# EAGLE schematic PJ22 (EAGLE 7.4.0)
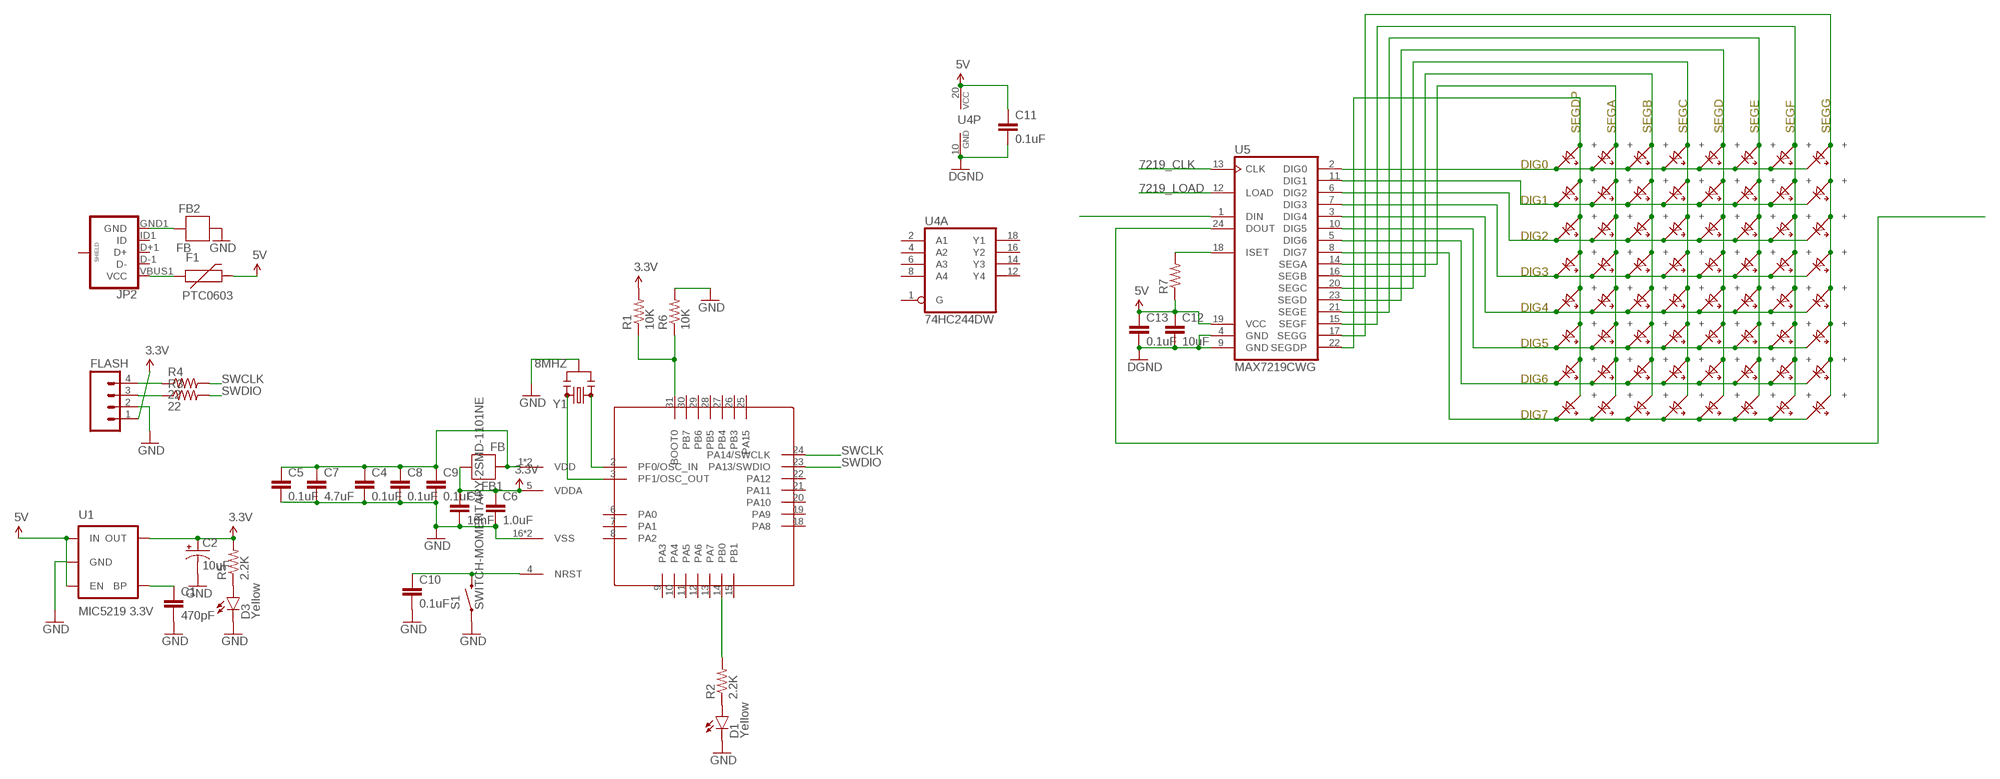
[diagram p0: schematic, sheet 1]

## Parts
C1  470pF  CAP0402-CAP  [0402-CAP]
C2  10uF  10UF-16V-10%(TANT)  [EIA3216]
C3  10nF  CAP0402-CAP  [0402-CAP]
C4  0.1uF  CAP0402-CAP  [0402-CAP]
C5  0.1uF  CAP0402-CAP  [0402-CAP]
C6  1.0uF  1.0UF-16V-10%(0603)  [0603-CAP]
C7  4.7uF  4.7UF-6.3V-10%(0603)0603  [0603-CAP]
C8  0.1uF  CAP0402-CAP  [0402-CAP]
C9  0.1uF  CAP0402-CAP  [0402-CAP]
C10  0.1uF  CAP0402-CAP  [0402-CAP]
C11  0.1uF  0.1UF-25V-5%(0603)  [0603-CAP]
C12  10uF  10UF50V20%(1210)  [1210]
C13  0.1uF  0.1UF-25V-5%(0603)  [0603-CAP]
D1  Yellow  LED-YELLOW0603  [LED-0603]
D3  Yellow  LED-YELLOW0603  [LED-0603]
DC1  LED_COMP  [LED_COMP]
DC2  LED_COMP  [LED_COMP]
DC3  LED_COMP  [LED_COMP]
DC4  LED_COMP  [LED_COMP]
DC5  LED_COMP  [LED_COMP]
DC6  LED_COMP  [LED_COMP]
DC7  LED_COMP  [LED_COMP]
DC8  LED_COMP  [LED_COMP]
DC9  LED_COMP  [LED_COMP]
DC10  LED_COMP  [LED_COMP]
DC11  LED_COMP  [LED_COMP]
DC12  LED_COMP  [LED_COMP]
DC13  LED_COMP  [LED_COMP]
DC14  LED_COMP  [LED_COMP]
DC15  LED_COMP  [LED_COMP]
DC16  LED_COMP  [LED_COMP]
DC17  LED_COMP  [LED_COMP]
DC18  LED_COMP  [LED_COMP]
DC19  LED_COMP  [LED_COMP]
DC20  LED_COMP  [LED_COMP]
DC21  LED_COMP  [LED_COMP]
DC22  LED_COMP  [LED_COMP]
DC23  LED_COMP  [LED_COMP]
DC24  LED_COMP  [LED_COMP]
DC25  LED_COMP  [LED_COMP]
DC26  LED_COMP  [LED_COMP]
DC27  LED_COMP  [LED_COMP]
DC28  LED_COMP  [LED_COMP]
DC29  LED_COMP  [LED_COMP]
DC30  LED_COMP  [LED_COMP]
DC31  LED_COMP  [LED_COMP]
DC32  LED_COMP  [LED_COMP]
DC33  LED_COMP  [LED_COMP]
DC34  LED_COMP  [LED_COMP]
DC35  LED_COMP  [LED_COMP]
DC36  LED_COMP  [LED_COMP]
DC37  LED_COMP  [LED_COMP]
DC38  LED_COMP  [LED_COMP]
DC39  LED_COMP  [LED_COMP]
DC40  LED_COMP  [LED_COMP]
DC41  LED_COMP  [LED_COMP]
DC42  LED_COMP  [LED_COMP]
DC43  LED_COMP  [LED_COMP]
DC44  LED_COMP  [LED_COMP]
DC45  LED_COMP  [LED_COMP]
DC46  LED_COMP  [LED_COMP]
DC47  LED_COMP  [LED_COMP]
DC48  LED_COMP  [LED_COMP]
DC49  LED_COMP  [LED_COMP]
DC50  LED_COMP  [LED_COMP]
DC51  LED_COMP  [LED_COMP]
DC52  LED_COMP  [LED_COMP]
DC53  LED_COMP  [LED_COMP]
DC54  LED_COMP  [LED_COMP]
DC55  LED_COMP  [LED_COMP]
DC56  LED_COMP  [LED_COMP]
DC57  LED_COMP  [LED_COMP]
DC58  LED_COMP  [LED_COMP]
DC59  LED_COMP  [LED_COMP]
DC60  LED_COMP  [LED_COMP]
DC61  LED_COMP  [LED_COMP]
DC62  LED_COMP  [LED_COMP]
DC63  LED_COMP  [LED_COMP]
DC64  LED_COMP  [LED_COMP]
F1  PTC0603  [0603]
FB1  FB  [0603]
FB2  FB  [0603]
FLASH  M04SMD  [1X04-SMD]
JP2  USB_MICROB_PLUGCONN-11752  [USB-B-MICRO-SMD_V03]
R1  10K  22OHM1/10W1%(0402)  [0402-RES]
R2  2.2K  RESISTOR0402  [0402-RES]
R3  22  22OHM1/10W1%(0402)  [0402-RES]
R4  22  22OHM1/10W1%(0402)  [0402-RES]
R5  2.2K  RESISTOR0402  [0402-RES]
R6  10K  22OHM1/10W1%(0402)  [0402-RES]
R7  RESISTOR0805-RES  [0805]
S1  SWITCH-MOMENTARY-2SMD-1101NE  [TACTILE-SWITCH-1101NE]
U1  MIC5219 3.3V  V_REG_MIC52193.3V  [SOT23-5]
U2  STM32F030K6P6  [LQFP32-0.8]
U4  74HC244DW  [SO20W]
U5  MAX7219CWG  [SO24L]
Y1  8MHZ  RESONATOR8MHZ  [RESONATOR-SMD]

## Nets
3.3V: C2.A(+) C3.1 C6.1 FB1.1 FLASH.1 R1.2 R5.2 U1.5(OUT) U2.5(VDDA)
5V: C11.1 C12.1 C13.1 F1.2 R7.1 U1.1(IN) U1.3(EN) U4.20(P:VCC) U5.19(VCC)
7219_CLK: U5.13(CLK)
7219_LOAD: U5.12(LOAD)
COPOY: C1.2 C2.C(-) C3.2 C4.2 C5.2 C6.2 C7.2 C8.2 C9.2 C10.2 D1.C D3.C FB2.1 FLASH.2 R6.2 S1.1 U1.2(GND) U2.16(VSS) U2.32(VSS) Y1.2 ; supply symbol labelled GND
GND: C11.2 C12.2 C13.2 U4.10(P:GND) U5.4(GND) U5.9(GND) ; supply symbol labelled DGND
N$1: C4.1 C5.1 C7.1 C8.1 C9.1 FB1.2 U2.1(VDD) U2.17(VDD)
N$2: DC1.0603-(-) DC1.0805-(-) DC1.1206-(-) DC1.3528-(-) DC1.5050-1(-) DC1.5050-3(-) DC1.5050-5(-) DC2.0603-(-) DC2.0805-(-) DC2.1206-(-) DC2.3528-(-) DC2.5050-1(-) DC2.5050-3(-) DC2.5050-5(-) DC3.0603-(-) DC3.0805-(-) DC3.1206-(-) DC3.3528-(-) DC3.5050-1(-) DC3.5050-3(-) DC3.5050-5(-) DC4.0603-(-) DC4.0805-(-) DC4.1206-(-) DC4.3528-(-) DC4.5050-1(-) DC4.5050-3(-) DC4.5050-5(-) DC5.0603-(-) DC5.0805-(-) DC5.1206-(-) DC5.3528-(-) DC5.5050-1(-) DC5.5050-3(-) DC5.5050-5(-) DC6.0603-(-) DC6.0805-(-) DC6.1206-(-) DC6.3528-(-) DC6.5050-1(-) DC6.5050-3(-) DC6.5050-5(-) DC7.0603-(-) DC7.0805-(-) DC7.1206-(-) DC7.3528-(-) DC7.5050-1(-) DC7.5050-3(-) DC7.5050-5(-) DC8.0603-(-) DC8.0805-(-) DC8.1206-(-) DC8.3528-(-) DC8.5050-1(-) DC8.5050-3(-) DC8.5050-5(-) U5.2(DIG0)
N$3: C1.1 U1.4(BP)
N$4: FLASH.3 R3.1
N$5: FLASH.4 R4.1
N$6: DC9.0603-(-) DC9.0805-(-) DC9.1206-(-) DC9.3528-(-) DC9.5050-1(-) DC9.5050-3(-) DC9.5050-5(-) DC10.0603-(-) DC10.0805-(-) DC10.1206-(-) DC10.3528-(-) DC10.5050-1(-) DC10.5050-3(-) DC10.5050-5(-) DC11.0603-(-) DC11.0805-(-) DC11.1206-(-) DC11.3528-(-) DC11.5050-1(-) DC11.5050-3(-) DC11.5050-5(-) DC12.0603-(-) DC12.0805-(-) DC12.1206-(-) DC12.3528-(-) DC12.5050-1(-) DC12.5050-3(-) DC12.5050-5(-) DC13.0603-(-) DC13.0805-(-) DC13.1206-(-) DC13.3528-(-) DC13.5050-1(-) DC13.5050-3(-) DC13.5050-5(-) DC14.0603-(-) DC14.0805-(-) DC14.1206-(-) DC14.3528-(-) DC14.5050-1(-) DC14.5050-3(-) DC14.5050-5(-) DC15.0603-(-) DC15.0805-(-) DC15.1206-(-) DC15.3528-(-) DC15.5050-1(-) DC15.5050-3(-) DC15.5050-5(-) DC16.0603-(-) DC16.0805-(-) DC16.1206-(-) DC16.3528-(-) DC16.5050-1(-) DC16.5050-3(-) DC16.5050-5(-) U5.11(DIG1)
N$7: D1.A R2.1
N$8: DC1.0603+(+) DC1.0805+(+) DC1.1206+(+) DC1.3528+(+) DC1.5050-2(+) DC1.5050-4(+) DC1.5050-6(+) DC9.0603+(+) DC9.0805+(+) DC9.1206+(+) DC9.3528+(+) DC9.5050-2(+) DC9.5050-4(+) DC9.5050-6(+) DC17.0603+(+) DC17.0805+(+) DC17.1206+(+) DC17.3528+(+) DC17.5050-2(+) DC17.5050-4(+) DC17.5050-6(+) DC25.0603+(+) DC25.0805+(+) DC25.1206+(+) DC25.3528+(+) DC25.5050-2(+) DC25.5050-4(+) DC25.5050-6(+) DC33.0603+(+) DC33.0805+(+) DC33.1206+(+) DC33.3528+(+) DC33.5050-2(+) DC33.5050-4(+) DC33.5050-6(+) DC41.0603+(+) DC41.0805+(+) DC41.1206+(+) DC41.3528+(+) DC41.5050-2(+) DC41.5050-4(+) DC41.5050-6(+) DC49.0603+(+) DC49.0805+(+) DC49.1206+(+) DC49.3528+(+) DC49.5050-2(+) DC49.5050-4(+) DC49.5050-6(+) DC57.0603+(+) DC57.0805+(+) DC57.1206+(+) DC57.3528+(+) DC57.5050-2(+) DC57.5050-4(+) DC57.5050-6(+) U5.22(SEGDP)
N$9: R1.1 R6.1 U2.31(BOOT0)
N$10: DC2.0603+(+) DC2.0805+(+) DC2.1206+(+) DC2.3528+(+) DC2.5050-2(+) DC2.5050-4(+) DC2.5050-6(+) DC10.0603+(+) DC10.0805+(+) DC10.1206+(+) DC10.3528+(+) DC10.5050-2(+) DC10.5050-4(+) DC10.5050-6(+) DC18.0603+(+) DC18.0805+(+) DC18.1206+(+) DC18.3528+(+) DC18.5050-2(+) DC18.5050-4(+) DC18.5050-6(+) DC26.0603+(+) DC26.0805+(+) DC26.1206+(+) DC26.3528+(+) DC26.5050-2(+) DC26.5050-4(+) DC26.5050-6(+) DC34.0603+(+) DC34.0805+(+) DC34.1206+(+) DC34.3528+(+) DC34.5050-2(+) DC34.5050-4(+) DC34.5050-6(+) DC42.0603+(+) DC42.0805+(+) DC42.1206+(+) DC42.3528+(+) DC42.5050-2(+) DC42.5050-4(+) DC42.5050-6(+) DC50.0603+(+) DC50.0805+(+) DC50.1206+(+) DC50.3528+(+) DC50.5050-2(+) DC50.5050-4(+) DC50.5050-6(+) DC58.0603+(+) DC58.0805+(+) DC58.1206+(+) DC58.3528+(+) DC58.5050-2(+) DC58.5050-4(+) DC58.5050-6(+) U5.14(SEGA)
N$11: FB2.2 JP2.GND1(GND)
N$12: F1.1 JP2.VBUS1(VCC)
N$13: DC3.0603+(+) DC3.0805+(+) DC3.1206+(+) DC3.3528+(+) DC3.5050-2(+) DC3.5050-4(+) DC3.5050-6(+) DC11.0603+(+) DC11.0805+(+) DC11.1206+(+) DC11.3528+(+) DC11.5050-2(+) DC11.5050-4(+) DC11.5050-6(+) DC19.0603+(+) DC19.0805+(+) DC19.1206+(+) DC19.3528+(+) DC19.5050-2(+) DC19.5050-4(+) DC19.5050-6(+) DC27.0603+(+) DC27.0805+(+) DC27.1206+(+) DC27.3528+(+) DC27.5050-2(+) DC27.5050-4(+) DC27.5050-6(+) DC35.0603+(+) DC35.0805+(+) DC35.1206+(+) DC35.3528+(+) DC35.5050-2(+) DC35.5050-4(+) DC35.5050-6(+) DC43.0603+(+) DC43.0805+(+) DC43.1206+(+) DC43.3528+(+) DC43.5050-2(+) DC43.5050-4(+) DC43.5050-6(+) DC51.0603+(+) DC51.0805+(+) DC51.1206+(+) DC51.3528+(+) DC51.5050-2(+) DC51.5050-4(+) DC51.5050-6(+) DC59.0603+(+) DC59.0805+(+) DC59.1206+(+) DC59.3528+(+) DC59.5050-2(+) DC59.5050-4(+) DC59.5050-6(+) U5.16(SEGB)
N$14: DC4.0603+(+) DC4.0805+(+) DC4.1206+(+) DC4.3528+(+) DC4.5050-2(+) DC4.5050-4(+) DC4.5050-6(+) DC12.0603+(+) DC12.0805+(+) DC12.1206+(+) DC12.3528+(+) DC12.5050-2(+) DC12.5050-4(+) DC12.5050-6(+) DC20.0603+(+) DC20.0805+(+) DC20.1206+(+) DC20.3528+(+) DC20.5050-2(+) DC20.5050-4(+) DC20.5050-6(+) DC28.0603+(+) DC28.0805+(+) DC28.1206+(+) DC28.3528+(+) DC28.5050-2(+) DC28.5050-4(+) DC28.5050-6(+) DC36.0603+(+) DC36.0805+(+) DC36.1206+(+) DC36.3528+(+) DC36.5050-2(+) DC36.5050-4(+) DC36.5050-6(+) DC44.0603+(+) DC44.0805+(+) DC44.1206+(+) DC44.3528+(+) DC44.5050-2(+) DC44.5050-4(+) DC44.5050-6(+) DC52.0603+(+) DC52.0805+(+) DC52.1206+(+) DC52.3528+(+) DC52.5050-2(+) DC52.5050-4(+) DC52.5050-6(+) DC60.0603+(+) DC60.0805+(+) DC60.1206+(+) DC60.3528+(+) DC60.5050-2(+) DC60.5050-4(+) DC60.5050-6(+) U5.20(SEGC)
N$15: DC5.0603+(+) DC5.0805+(+) DC5.1206+(+) DC5.3528+(+) DC5.5050-2(+) DC5.5050-4(+) DC5.5050-6(+) DC13.0603+(+) DC13.0805+(+) DC13.1206+(+) DC13.3528+(+) DC13.5050-2(+) DC13.5050-4(+) DC13.5050-6(+) DC21.0603+(+) DC21.0805+(+) DC21.1206+(+) DC21.3528+(+) DC21.5050-2(+) DC21.5050-4(+) DC21.5050-6(+) DC29.0603+(+) DC29.0805+(+) DC29.1206+(+) DC29.3528+(+) DC29.5050-2(+) DC29.5050-4(+) DC29.5050-6(+) DC37.0603+(+) DC37.0805+(+) DC37.1206+(+) DC37.3528+(+) DC37.5050-2(+) DC37.5050-4(+) DC37.5050-6(+) DC45.0603+(+) DC45.0805+(+) DC45.1206+(+) DC45.3528+(+) DC45.5050-2(+) DC45.5050-4(+) DC45.5050-6(+) DC53.0603+(+) DC53.0805+(+) DC53.1206+(+) DC53.3528+(+) DC53.5050-2(+) DC53.5050-4(+) DC53.5050-6(+) DC61.0603+(+) DC61.0805+(+) DC61.1206+(+) DC61.3528+(+) DC61.5050-2(+) DC61.5050-4(+) DC61.5050-6(+) U5.23(SEGD)
N$16: DC6.0603+(+) DC6.0805+(+) DC6.1206+(+) DC6.3528+(+) DC6.5050-2(+) DC6.5050-4(+) DC6.5050-6(+) DC14.0603+(+) DC14.0805+(+) DC14.1206+(+) DC14.3528+(+) DC14.5050-2(+) DC14.5050-4(+) DC14.5050-6(+) DC22.0603+(+) DC22.0805+(+) DC22.1206+(+) DC22.3528+(+) DC22.5050-2(+) DC22.5050-4(+) DC22.5050-6(+) DC30.0603+(+) DC30.0805+(+) DC30.1206+(+) DC30.3528+(+) DC30.5050-2(+) DC30.5050-4(+) DC30.5050-6(+) DC38.0603+(+) DC38.0805+(+) DC38.1206+(+) DC38.3528+(+) DC38.5050-2(+) DC38.5050-4(+) DC38.5050-6(+) DC46.0603+(+) DC46.0805+(+) DC46.1206+(+) DC46.3528+(+) DC46.5050-2(+) DC46.5050-4(+) DC46.5050-6(+) DC54.0603+(+) DC54.0805+(+) DC54.1206+(+) DC54.3528+(+) DC54.5050-2(+) DC54.5050-4(+) DC54.5050-6(+) DC62.0603+(+) DC62.0805+(+) DC62.1206+(+) DC62.3528+(+) DC62.5050-2(+) DC62.5050-4(+) DC62.5050-6(+) U5.21(SEGE)
N$17: DC7.0603+(+) DC7.0805+(+) DC7.1206+(+) DC7.3528+(+) DC7.5050-2(+) DC7.5050-4(+) DC7.5050-6(+) DC15.0603+(+) DC15.0805+(+) DC15.1206+(+) DC15.3528+(+) DC15.5050-2(+) DC15.5050-4(+) DC15.5050-6(+) DC23.0603+(+) DC23.0805+(+) DC23.1206+(+) DC23.3528+(+) DC23.5050-2(+) DC23.5050-4(+) DC23.5050-6(+) DC31.0603+(+) DC31.0805+(+) DC31.1206+(+) DC31.3528+(+) DC31.5050-2(+) DC31.5050-4(+) DC31.5050-6(+) DC39.0603+(+) DC39.0805+(+) DC39.1206+(+) DC39.3528+(+) DC39.5050-2(+) DC39.5050-4(+) DC39.5050-6(+) DC47.0603+(+) DC47.0805+(+) DC47.1206+(+) DC47.3528+(+) DC47.5050-2(+) DC47.5050-4(+) DC47.5050-6(+) DC55.0603+(+) DC55.0805+(+) DC55.1206+(+) DC55.3528+(+) DC55.5050-2(+) DC55.5050-4(+) DC55.5050-6(+) DC63.0603+(+) DC63.0805+(+) DC63.1206+(+) DC63.3528+(+) DC63.5050-2(+) DC63.5050-4(+) DC63.5050-6(+) U5.15(SEGF)
N$18: DC8.0603+(+) DC8.0805+(+) DC8.1206+(+) DC8.3528+(+) DC8.5050-2(+) DC8.5050-4(+) DC8.5050-6(+) DC16.0603+(+) DC16.0805+(+) DC16.1206+(+) DC16.3528+(+) DC16.5050-2(+) DC16.5050-4(+) DC16.5050-6(+) DC24.0603+(+) DC24.0805+(+) DC24.1206+(+) DC24.3528+(+) DC24.5050-2(+) DC24.5050-4(+) DC24.5050-6(+) DC32.0603+(+) DC32.0805+(+) DC32.1206+(+) DC32.3528+(+) DC32.5050-2(+) DC32.5050-4(+) DC32.5050-6(+) DC40.0603+(+) DC40.0805+(+) DC40.1206+(+) DC40.3528+(+) DC40.5050-2(+) DC40.5050-4(+) DC40.5050-6(+) DC48.0603+(+) DC48.0805+(+) DC48.1206+(+) DC48.3528+(+) DC48.5050-2(+) DC48.5050-4(+) DC48.5050-6(+) DC56.0603+(+) DC56.0805+(+) DC56.1206+(+) DC56.3528+(+) DC56.5050-2(+) DC56.5050-4(+) DC56.5050-6(+) DC64.0603+(+) DC64.0805+(+) DC64.1206+(+) DC64.3528+(+) DC64.5050-2(+) DC64.5050-4(+) DC64.5050-6(+) U5.17(SEGG)
N$19: DC17.0603-(-) DC17.0805-(-) DC17.1206-(-) DC17.3528-(-) DC17.5050-1(-) DC17.5050-3(-) DC17.5050-5(-) DC18.0603-(-) DC18.0805-(-) DC18.1206-(-) DC18.3528-(-) DC18.5050-1(-) DC18.5050-3(-) DC18.5050-5(-) DC19.0603-(-) DC19.0805-(-) DC19.1206-(-) DC19.3528-(-) DC19.5050-1(-) DC19.5050-3(-) DC19.5050-5(-) DC20.0603-(-) DC20.0805-(-) DC20.1206-(-) DC20.3528-(-) DC20.5050-1(-) DC20.5050-3(-) DC20.5050-5(-) DC21.0603-(-) DC21.0805-(-) DC21.1206-(-) DC21.3528-(-) DC21.5050-1(-) DC21.5050-3(-) DC21.5050-5(-) DC22.0603-(-) DC22.0805-(-) DC22.1206-(-) DC22.3528-(-) DC22.5050-1(-) DC22.5050-3(-) DC22.5050-5(-) DC23.0603-(-) DC23.0805-(-) DC23.1206-(-) DC23.3528-(-) DC23.5050-1(-) DC23.5050-3(-) DC23.5050-5(-) DC24.0603-(-) DC24.0805-(-) DC24.1206-(-) DC24.3528-(-) DC24.5050-1(-) DC24.5050-3(-) DC24.5050-5(-) U5.6(DIG2)
N$20: DC25.0603-(-) DC25.0805-(-) DC25.1206-(-) DC25.3528-(-) DC25.5050-1(-) DC25.5050-3(-) DC25.5050-5(-) DC26.0603-(-) DC26.0805-(-) DC26.1206-(-) DC26.3528-(-) DC26.5050-1(-) DC26.5050-3(-) DC26.5050-5(-) DC27.0603-(-) DC27.0805-(-) DC27.1206-(-) DC27.3528-(-) DC27.5050-1(-) DC27.5050-3(-) DC27.5050-5(-) DC28.0603-(-) DC28.0805-(-) DC28.1206-(-) DC28.3528-(-) DC28.5050-1(-) DC28.5050-3(-) DC28.5050-5(-) DC29.0603-(-) DC29.0805-(-) DC29.1206-(-) DC29.3528-(-) DC29.5050-1(-) DC29.5050-3(-) DC29.5050-5(-) DC30.0603-(-) DC30.0805-(-) DC30.1206-(-) DC30.3528-(-) DC30.5050-1(-) DC30.5050-3(-) DC30.5050-5(-) DC31.0603-(-) DC31.0805-(-) DC31.1206-(-) DC31.3528-(-) DC31.5050-1(-) DC31.5050-3(-) DC31.5050-5(-) DC32.0603-(-) DC32.0805-(-) DC32.1206-(-) DC32.3528-(-) DC32.5050-1(-) DC32.5050-3(-) DC32.5050-5(-) U5.7(DIG3)
N$21: DC33.0603-(-) DC33.0805-(-) DC33.1206-(-) DC33.3528-(-) DC33.5050-1(-) DC33.5050-3(-) DC33.5050-5(-) DC34.0603-(-) DC34.0805-(-) DC34.1206-(-) DC34.3528-(-) DC34.5050-1(-) DC34.5050-3(-) DC34.5050-5(-) DC35.0603-(-) DC35.0805-(-) DC35.1206-(-) DC35.3528-(-) DC35.5050-1(-) DC35.5050-3(-) DC35.5050-5(-) DC36.0603-(-) DC36.0805-(-) DC36.1206-(-) DC36.3528-(-) DC36.5050-1(-) DC36.5050-3(-) DC36.5050-5(-) DC37.0603-(-) DC37.0805-(-) DC37.1206-(-) DC37.3528-(-) DC37.5050-1(-) DC37.5050-3(-) DC37.5050-5(-) DC38.0603-(-) DC38.0805-(-) DC38.1206-(-) DC38.3528-(-) DC38.5050-1(-) DC38.5050-3(-) DC38.5050-5(-) DC39.0603-(-) DC39.0805-(-) DC39.1206-(-) DC39.3528-(-) DC39.5050-1(-) DC39.5050-3(-) DC39.5050-5(-) DC40.0603-(-) DC40.0805-(-) DC40.1206-(-) DC40.3528-(-) DC40.5050-1(-) DC40.5050-3(-) DC40.5050-5(-) U5.3(DIG4)
N$22: DC41.0603-(-) DC41.0805-(-) DC41.1206-(-) DC41.3528-(-) DC41.5050-1(-) DC41.5050-3(-) DC41.5050-5(-) DC42.0603-(-) DC42.0805-(-) DC42.1206-(-) DC42.3528-(-) DC42.5050-1(-) DC42.5050-3(-) DC42.5050-5(-) DC43.0603-(-) DC43.0805-(-) DC43.1206-(-) DC43.3528-(-) DC43.5050-1(-) DC43.5050-3(-) DC43.5050-5(-) DC44.0603-(-) DC44.0805-(-) DC44.1206-(-) DC44.3528-(-) DC44.5050-1(-) DC44.5050-3(-) DC44.5050-5(-) DC45.0603-(-) DC45.0805-(-) DC45.1206-(-) DC45.3528-(-) DC45.5050-1(-) DC45.5050-3(-) DC45.5050-5(-) DC46.0603-(-) DC46.0805-(-) DC46.1206-(-) DC46.3528-(-) DC46.5050-1(-) DC46.5050-3(-) DC46.5050-5(-) DC47.0603-(-) DC47.0805-(-) DC47.1206-(-) DC47.3528-(-) DC47.5050-1(-) DC47.5050-3(-) DC47.5050-5(-) DC48.0603-(-) DC48.0805-(-) DC48.1206-(-) DC48.3528-(-) DC48.5050-1(-) DC48.5050-3(-) DC48.5050-5(-) U5.10(DIG5)
N$23: DC49.0603-(-) DC49.0805-(-) DC49.1206-(-) DC49.3528-(-) DC49.5050-1(-) DC49.5050-3(-) DC49.5050-5(-) DC50.0603-(-) DC50.0805-(-) DC50.1206-(-) DC50.3528-(-) DC50.5050-1(-) DC50.5050-3(-) DC50.5050-5(-) DC51.0603-(-) DC51.0805-(-) DC51.1206-(-) DC51.3528-(-) DC51.5050-1(-) DC51.5050-3(-) DC51.5050-5(-) DC52.0603-(-) DC52.0805-(-) DC52.1206-(-) DC52.3528-(-) DC52.5050-1(-) DC52.5050-3(-) DC52.5050-5(-) DC53.0603-(-) DC53.0805-(-) DC53.1206-(-) DC53.3528-(-) DC53.5050-1(-) DC53.5050-3(-) DC53.5050-5(-) DC54.0603-(-) DC54.0805-(-) DC54.1206-(-) DC54.3528-(-) DC54.5050-1(-) DC54.5050-3(-) DC54.5050-5(-) DC55.0603-(-) DC55.0805-(-) DC55.1206-(-) DC55.3528-(-) DC55.5050-1(-) DC55.5050-3(-) DC55.5050-5(-) DC56.0603-(-) DC56.0805-(-) DC56.1206-(-) DC56.3528-(-) DC56.5050-1(-) DC56.5050-3(-) DC56.5050-5(-) U5.5(DIG6)
N$24: DC57.0603-(-) DC57.0805-(-) DC57.1206-(-) DC57.3528-(-) DC57.5050-1(-) DC57.5050-3(-) DC57.5050-5(-) DC58.0603-(-) DC58.0805-(-) DC58.1206-(-) DC58.3528-(-) DC58.5050-1(-) DC58.5050-3(-) DC58.5050-5(-) DC59.0603-(-) DC59.0805-(-) DC59.1206-(-) DC59.3528-(-) DC59.5050-1(-) DC59.5050-3(-) DC59.5050-5(-) DC60.0603-(-) DC60.0805-(-) DC60.1206-(-) DC60.3528-(-) DC60.5050-1(-) DC60.5050-3(-) DC60.5050-5(-) DC61.0603-(-) DC61.0805-(-) DC61.1206-(-) DC61.3528-(-) DC61.5050-1(-) DC61.5050-3(-) DC61.5050-5(-) DC62.0603-(-) DC62.0805-(-) DC62.1206-(-) DC62.3528-(-) DC62.5050-1(-) DC62.5050-3(-) DC62.5050-5(-) DC63.0603-(-) DC63.0805-(-) DC63.1206-(-) DC63.3528-(-) DC63.5050-1(-) DC63.5050-3(-) DC63.5050-5(-) DC64.0603-(-) DC64.0805-(-) DC64.1206-(-) DC64.3528-(-) DC64.5050-1(-) DC64.5050-3(-) DC64.5050-5(-) U5.8(DIG7)
N$26: R7.2 U5.18(ISET)
N$27: U5.1(DIN)
N$28: U5.24(DOUT)
N$32: D3.A R5.1
NRST: C10.1 S1.2 U2.4(NRST)
PB0: R2.2 U2.14(PB0)
PF0: U2.2(PF0/OSC_IN) Y1.1
PF1: U2.3(PF1/OSC_OUT) Y1.3
SWCLK: R4.2 U2.24(PA14/SWCLK)
SWDIO: R3.2 U2.23(PA13/SWDIO)
Unconnected: JP2.D+1(D+) JP2.D-1(D-) JP2.ID1(ID) JP2.SHIELD1(SHIELD) JP2.SHIELD2(SHIELD) JP2.SHIELD3(SHIELD) U2.6(PA0) U2.7(PA1) U2.8(PA2) U2.9(PA3) U2.10(PA4) U2.11(PA5) U2.12(PA6) U2.13(PA7) U2.15(PB1) U2.18(PA8) U2.19(PA9) U2.20(PA10) U2.21(PA11) U2.22(PA12) U2.25(PA15) U2.26(PB3) U2.27(PB4) U2.28(PB5) U2.29(PB6) U2.30(PB7) U4.1(A:G) U4.2(A:A1) U4.3(B:Y4) U4.4(A:A2) U4.5(B:Y3) U4.6(A:A3) U4.7(B:Y2) U4.8(A:A4) U4.9(B:Y1) U4.11(B:A1) U4.12(A:Y4) U4.13(B:A2) U4.14(A:Y3) U4.15(B:A3) U4.16(A:Y2) U4.17(B:A4) U4.18(A:Y1) U4.19(B:G)

## Notes on the sheet
- SEGDP | SEGA | SEGB | SEGC | SEGD | SEGE | SEGF | SEGG
- DIG0
- DIG1
- DIG2
- DIG3
- DIG4
- DIG5
- DIG6
- DIG7

## Library data of the parts
C1 C3-C5 C8-C10 = SparkFun-Capacitors:CAP: Capacitor Standard 0603 ceramic capacitor, and 0.1" leaded capacitor.
C2 = SparkFun-Capacitors:10UF-16V-10%(TANT): CAP-00811 1206/EIA-3216 Tantalum capacitor; PROD_ID: CAP-00811
C6 = SparkFun-Capacitors:1.0UF-16V-10%(0603): CAP-00868; PROD_ID: CAP-00868
C7 = SparkFun-Capacitors:4.7UF-6.3V-10%(0603): CAP-08280; PROD_ID: CAP-08280
C11 C13 = SparkFun-Capacitors:0.1UF-25V-5%(0603): CAP-08604; PROD_ID: CAP-08604
C12 = SparkFun-Capacitors:10UF50V20%(1210): CAP-09824; PROD_ID: CAP-09824
D1 D3 = SparkFun-LED:LED-YELLOW: Yellow SMD LEDs LilyPad 1206- DIO-09909 0603- DIO-09003 "SMART" means more efficient and expensive; PROD_ID: DIO-09003
DC1-DC64 = PJ22:LED_COMP
F1 = SparkFun-PowerIC:PTC: Resettable Fuse PTC Resettable Fuse. Spark Fun Electronics SKU : COM-08357
FB1 FB2 = SparkFun-Passives:FB
FLASH = SparkFun-Connectors:M04: Header 4 Standard 4-pin 0.1" header. Use with straight break away headers (SKU : PRT-00116), right angle break away headers (PRT-00553), swiss pins (PRT-00743), machine pins (PRT-00117), and female headers (PRT-00115). Molex polarized connector foot print use with SKU : PRT-08231 with associated crimp pins and housings. 1MM SMD Version SKU: PRT-10208
JP2 = SparkFun-Connectors:USB_MICROB_PLUG: USB Micro-B connectors Some male, some female. Watch your step!; PROD_ID: CONN-11752
R1 R6 = SparkFun-Resistors:22OHM1/10W1%(0402); PROD_ID: RES-12427; VALUE: 22
R2 R5 R7 = SparkFun-Resistors:RESISTOR: Resistor Basic schematic elements and footprints for 0603, 1206, and PTH resistors.
R3 R4 = SparkFun-Resistors:22OHM1/10W1%(0402); PROD_ID: RES-12427
S1 = SparkFun-Electromechanical:SWITCH-MOMENTARY-2: Various NO switches- pushbuttons, reed, etc; PROD_ID: SWCH-00815
U1 = SparkFun-PowerIC:V_REG_MIC5219: V_REG MIC5219 Standard 3.3V and 5V 500mA LDO voltage regulator in SOT-23 layout. Micrel part MIC5219. BP (by-pass) pin is used to lower output noise with 470pF cap, may be left open.; PROD_ID: VREG-09872
U2 = r1:STM32F030K6P6
U4 = 74xx-eu:74*244: Octal BUFFER and LINE DRIVER, 3-state
U5 = maxim:MAX7219: LED DISPLAY DRIVER
Y1 = SparkFun-FreqCtrl:RESONATOR: Resonator Small SMD resonator. Used, eg, on the Arduino Pro/ Pro Mini boards. 8MHz- XTAL-08895 16MHz- XTAL-08900; PROD_ID: XTAL-08895